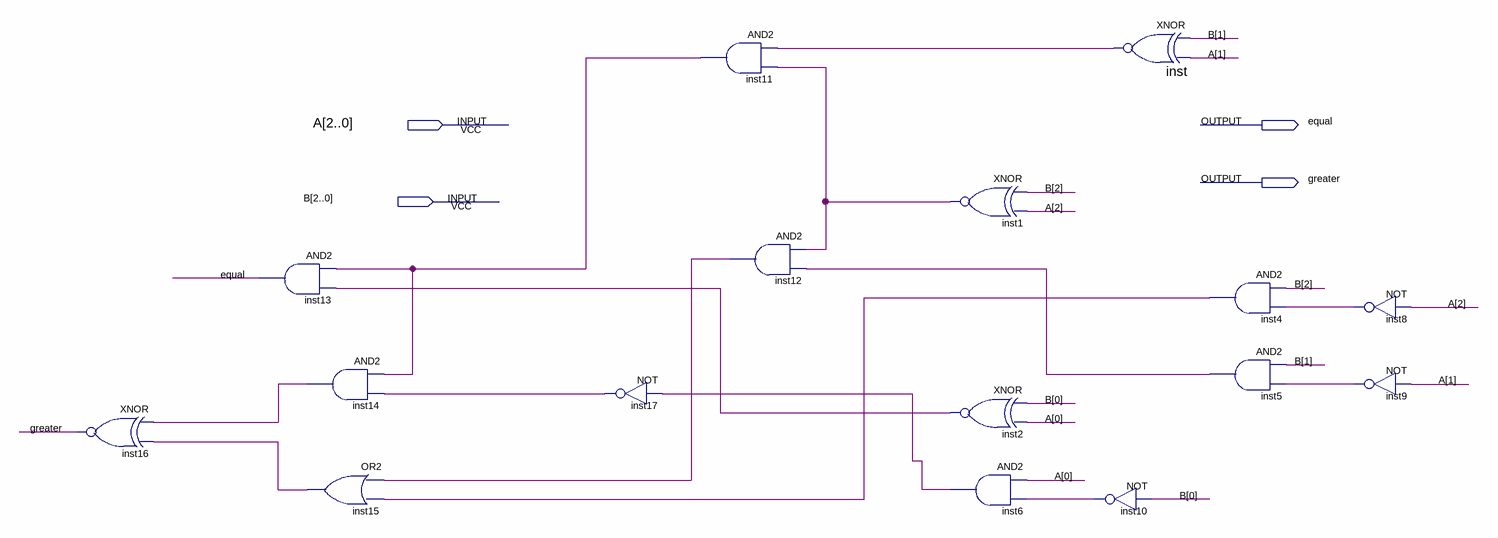
[diagram p0: schematic sheet]
// Quartus schematic Comparator.bdf as structural Verilog: 16 symbols, 4 pins
module Comparator (
  input  [2:0] A,
  input  [2:0] B,
  output equal,
  output greater
);

  wire inst1_out, inst2_out, inst4_out, inst5_out, inst6_out, inst8_out, inst9_out, inst10_out, inst11_out,
       inst12_out, inst14_out, inst15_out, inst17_out, inst_out;

  xnor inst16 (greater, inst14_out, inst15_out);
  and inst13 (equal, inst11_out, inst2_out);
  and inst14 (inst14_out, inst11_out, inst17_out);
  or inst15 (inst15_out, inst12_out, inst4_out);
  not inst17 (inst17_out, inst6_out);
  and inst11 (inst11_out, inst_out, inst1_out);
  and inst12 (inst12_out, inst1_out, inst5_out);
  xnor inst1 (inst1_out, B[2], A[2]);
  xnor inst2 (inst2_out, B[0], A[0]);
  and inst6 (inst6_out, A[0], inst10_out);
  xnor inst (inst_out, B[1], A[1]);
  not inst10 (inst10_out, B[0]);
  and inst4 (inst4_out, B[2], inst8_out);
  and inst5 (inst5_out, B[1], inst9_out);
  not inst8 (inst8_out, A[2]);
  not inst9 (inst9_out, A[1]);
endmodule
